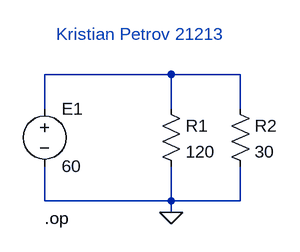
[diagram p0: schematic Draft1.asc]
Draft1.asc, the LTspice schematic file:
Version 4
SHEET 1 880 680
WIRE 272 96 96 96
WIRE 368 96 272 96
WIRE 96 144 96 96
WIRE 272 144 272 96
WIRE 368 144 368 96
WIRE 96 272 96 224
WIRE 272 272 272 224
WIRE 272 272 96 272
WIRE 368 272 368 224
WIRE 368 272 272 272
WIRE 272 288 272 272
FLAG 272 288 0
DATAFLAG 112 96 ""
DATAFLAG 368 96 ""
DATAFLAG 272 96 ""
DATAFLAG 256 272 ""
DATAFLAG 336 272 ""
SYMBOL voltage 96 128 R0
WINDOW 123 0 0 Left 0
WINDOW 39 0 0 Left 0
SYMATTR InstName E1
SYMATTR Value 60
SYMBOL res 256 128 R0
SYMATTR InstName R1
SYMATTR Value 120
SYMBOL res 352 128 R0
SYMATTR InstName R2
SYMATTR Value 30
TEXT 112 40 Left 2 ;Kristian Petrov 21213
TEXT 96 296 Left 2 !.op

The netlist it stands for:
* Draft1.asc
V§E1 N001 0 60
R1 N001 0 120
R2 N001 0 30
* Kristian Petrov 21213
.op
.backanno
.end